# Altium schematic sheet Display.SchDoc: display
size A4; DrawnBy: Nino Bleus; DocumentNumber: PXLEAI_2022_0001; Revision: 1.0.0; SheetNumber: 3; SheetTotal: 4
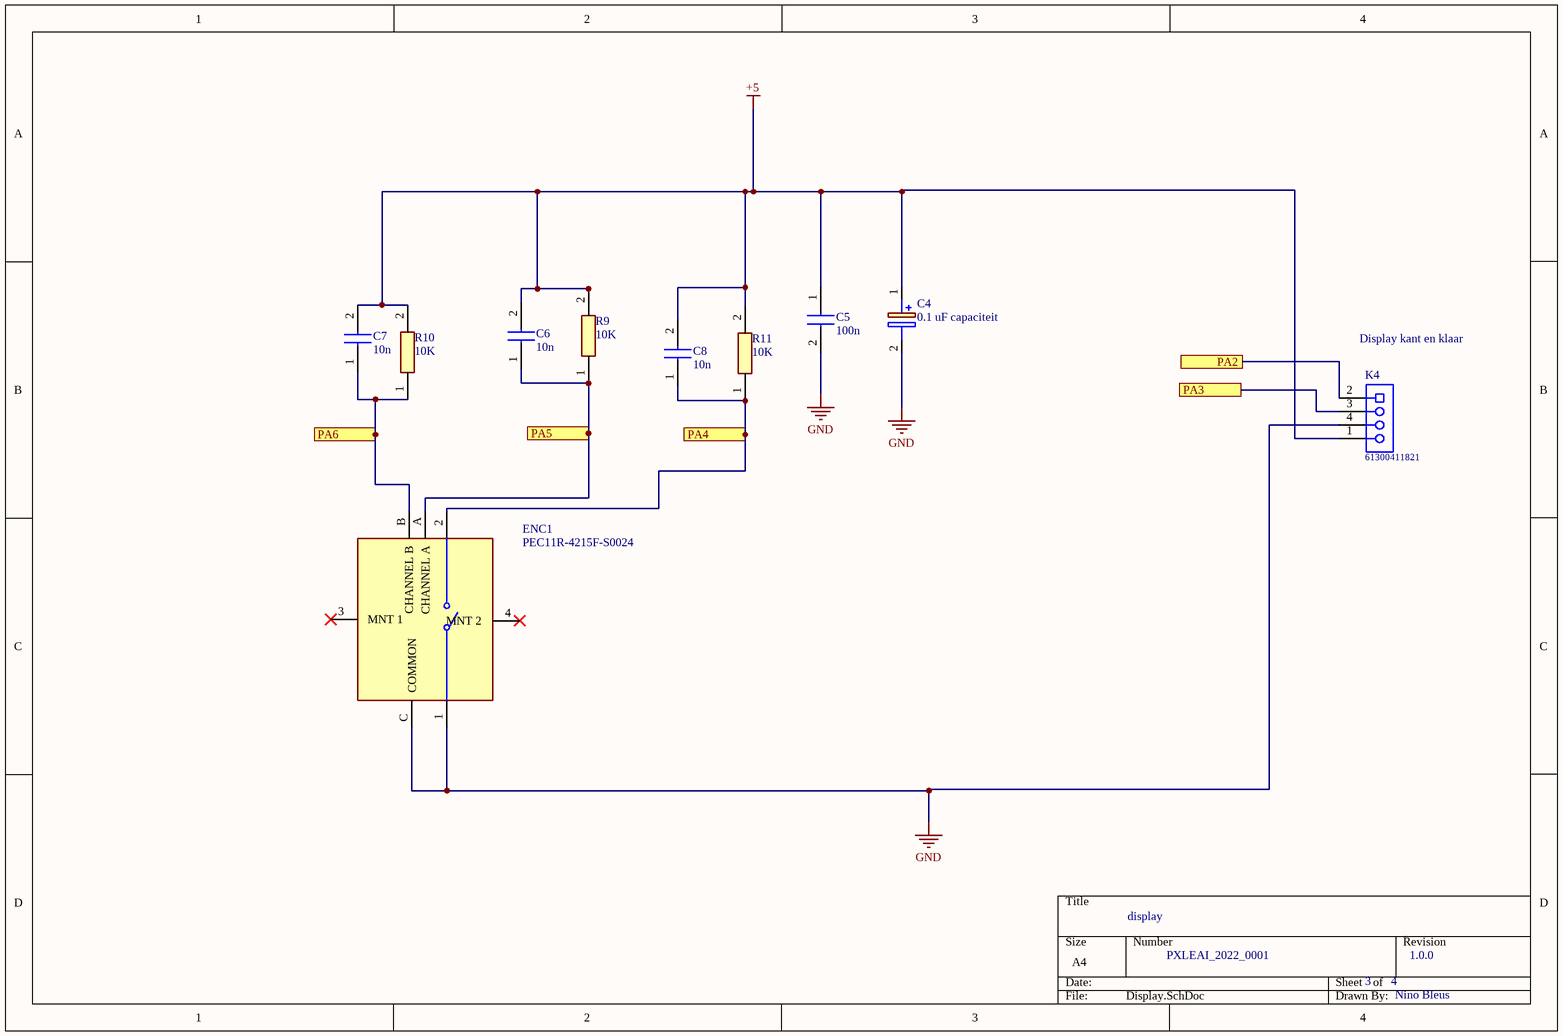
[diagram p0: Display.SchDoc]

## Parts
C4  0.1 uF capaciteit  [CAPPRD200W52D500H1250]
C5  100n  [CAPC2012X88N]
C6  10n  [CAPC2012X88N]
C7  10n  [CAPC2012X88N]
C8  10n  [CAPC2012X88N]
ENC1  PEC11R-4215F-S0024  [FP-PEC11R-4215F-S0024-MFG]
K4  61300411821  [61300411821]
R9  10K  [RESC2012X65N]
R10  10K  [RESC2012X65N]
R11  10K  [RESC2012X65N]

## Ports
PA2, PA3, PA4, PA5, PA6

## Nets
+5: C4.1(+) C5.1 C6.2 C7.2 C8.2 K4.1 R9.2 R10.2 R11.2
GND: C4.2(-) C5.2 ENC1.1 ENC1.C(COMMON) K4.4
PA2: K4.2 ; port PA2
PA3: K4.3 ; port PA3
PA4: C8.1 ENC1.2 R11.1 ; port PA4
PA5: C6.1 ENC1.A(CHANNEL_A) R9.1 ; port PA5
PA6: C7.1 ENC1.B(CHANNEL_B) R10.1 ; port PA6

Not connected (* = marked no-connect by the designer): ENC1 3(MNT_1)* 4(MNT_2)*

## Notes on the sheet
- (near K4) Display kant en klaar

## Library data of the parts
C4 = 0.1 uF capaciteit: Capacitor Polarised; Manufacturer_Name: Wurth Elektronik; Manufacturer_Part_Number: 860010672001; Datasheet Link: http://katalog.we-online.com/pbs/datasheet/860010672001.pdf; Height: 12.5mm
C5-C8 = C0805C103K5RACTU: Capacitor; Manufacturer_Name: Kemet; Datasheet Link: https://ms.componentsearchengine.com/Datasheets/2/C0805C103K5RACTU.pdf; Height: 0.88mm; Manufacturer_Part_Number: C0805C103K5RACTU
ENC1 = CMP-1747-00012-2: ROTARY ENCODER MECHANICAL 24PPR; Hole Diameter: 1.8mm; Output Type: Quadrature; Pulses per Revolution: 24; Number of Channels: 2; Built in Switch: Yes; Min Operating Temperature: -30°C; Series: PEC11R; Type: Mechanical; Package Quantity: 150; Length: 21.5mm; Max Operating Temperature: 70°C; Encoder Type: Mechanical; Height: 13.4mm; Detent: Yes; Packaging: Bulk; Orientation: Vertical; Width: 12.5mm; Termination: PC Pins; Mount: Through Hole; REACH SVHC: No SVHC; Radiation Hardening: No; RoHS Compliant: Yes
K4 = 61300411821: WR-PHD Socket Header, THT, pitch 2.54mm, Single Row, Vertical, 4p; Manufacturer: Wurth Elektronik; Pin Number: 4; Rated Current: 3A; Working Voltage: 250VAC; Withstanding Voltage: 500VAC; Contact Resistance: 20mOhm; ComponentLink1Description: Manufacturer; ComponentLink1URL: http://www.we-online.de; ComponentLink2Description: Datasheet; ComponentLink2URL: https://www.we-online.com/catalog/datasheet/61300411821.pdf; Manufacturer Part Number: 61300411821; Pitch: 2.54mm; Operating Temperature: -40 to +125degC; Mounting Technology: THT; Packaging: Tray; Gender: Socket Header; Row Number: Single; Orientation: Vertical
R9-R11 = ESR10EZPJ183: Resistor; Manufacturer_Name: ROHM Semiconductor; Datasheet Link: https://datasheet.datasheetarchive.com/originals/distributors/Datasheets_SAMA/30ccb516c688c96e56c83a00b77a93f4.pdf; Height: 0.65mm; Manufacturer_Part_Number: ESR10EZPJ183